# Altium schematic sheet lamps+antenna.SchDoc
size A3; SheetNumber: 1; SheetTotal: 1
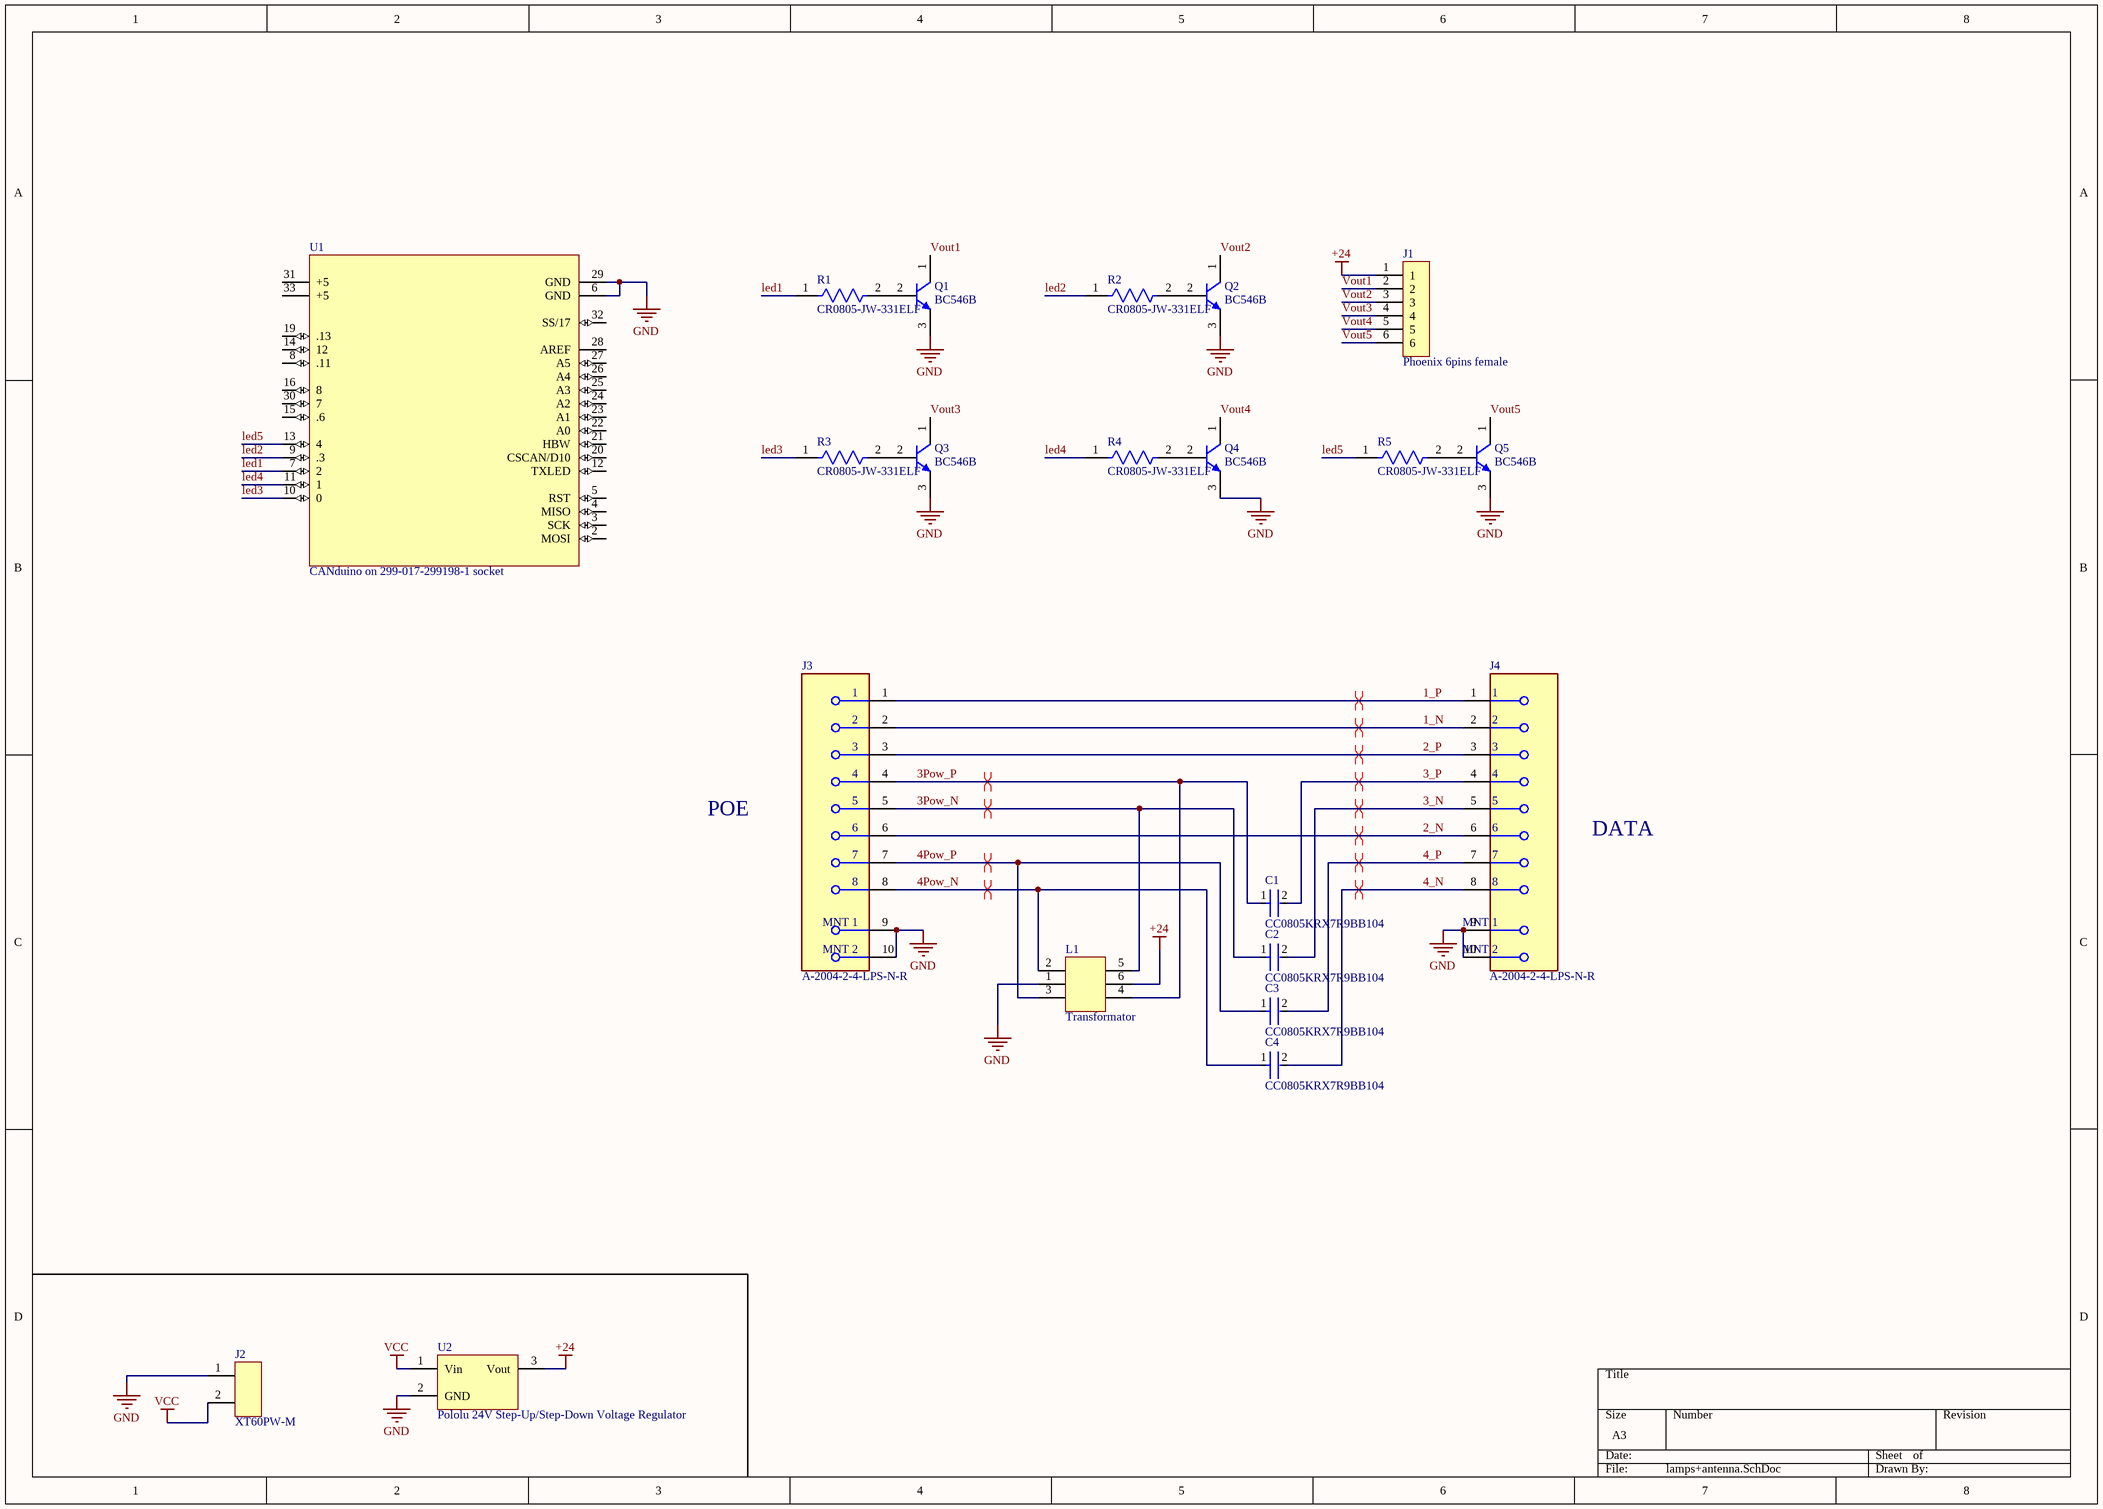
[diagram p0: lamps+antenna.SchDoc]

## Parts
C1  CC0805KRX7R9BB104  [FP-CC0805-0_85-IPC_A]
C2  CC0805KRX7R9BB104  [FP-CC0805-0_85-IPC_A]
C3  CC0805KRX7R9BB104  [FP-CC0805-0_85-IPC_A]
C4  CC0805KRX7R9BB104  [FP-CC0805-0_85-IPC_A]
J1  Phoenix 6pins female  [Phoenix 6pins female]
J2  XT60PW-M  [XT60PW-M]
J3  A-2004-2-4-LPS-N-R  [FP-A-2004-2-4-LPS-N-R-MFG]
J4  A-2004-2-4-LPS-N-R  [FP-A-2004-2-4-LPS-N-R-MFG]
L1  Transformator  [Transformator]
Q1  BC546B  [ONSC-TO-92-3-29-11]
Q2  BC546B  [ONSC-TO-92-3-29-11]
Q3  BC546B  [ONSC-TO-92-3-29-11]
Q4  BC546B  [ONSC-TO-92-3-29-11]
Q5  BC546B  [ONSC-TO-92-3-29-11]
R1  CR0805-JW-331ELF  [FP-CR0805-MFG]
R2  CR0805-JW-331ELF  [FP-CR0805-MFG]
R3  CR0805-JW-331ELF  [FP-CR0805-MFG]
R4  CR0805-JW-331ELF  [FP-CR0805-MFG]
R5  CR0805-JW-331ELF  [FP-CR0805-MFG]
U1  CANduino on 299-017-299198-1 socket  [CANduino on 299-017-299198-1 socket]
U2  Pololu 24V Step-Up/Step-Down Voltage Regulator  [S18V20F12]

## Nets
+24: J1.1 L1.6 U2.3(Vout)
GND: J2.1 J3.9(MNT_1) J3.10(MNT_2) J4.9(MNT_1) J4.10(MNT_2) L1.1 Q1.3(E) Q2.3(E) Q3.3(E) Q4.3(E) Q5.3(E) U1.6(GND) U1.29(GND) U2.2(GND)
VCC: J2.2 U2.1(Vin)
1_N: J3.2 J4.2
1_P: J3.1 J4.1
2_N: J3.6 J4.6
2_P: J3.3 J4.3
3_N: C2.2 J4.5
3_P: C1.2 J4.4
3Pow_N: C2.1 J3.5 L1.5
3Pow_P: C1.1 J3.4 L1.4
4_N: C4.2 J4.8
4_P: C3.2 J4.7
4Pow_N: C4.1 J3.8 L1.2
4Pow_P: C3.1 J3.7 L1.3
led1: R1.1 U1.7(2)
led2: R2.1 U1.9(.3)
led3: R3.1 U1.10(0)
led4: R4.1 U1.11(1)
led5: R5.1 U1.13(4)
Vout1: J1.2 Q1.1(C)
Vout2: J1.3 Q2.1(C)
Vout3: J1.4 Q3.1(C)
Vout4: J1.5 Q4.1(C)
Vout5: J1.6 Q5.1(C)
NetQ1_2: Q1.2(B) R1.2
NetQ2_2: Q2.2(B) R2.2
NetQ3_2: Q3.2(B) R3.2
NetQ4_2: Q4.2(B) R4.2
NetQ5_2: Q5.2(B) R5.2

Not connected (* = marked no-connect by the designer): U1 2(MOSI) 3(SCK) 4(MISO) 5(RST) 8(.11) 12(TXLED) 14(12) 15(.6) 16(8) 19(.13) 20(CSCAN/D10) 21(HBW) 22(A0) 23(A1) 24(A2) 25(A3) 26(A4) 27(A5) 28(AREF) 30(7) 31(+5) 32(SS/17) 33(+5)

## Layout directives
differential pair: 1_N, 1_P, 2_N, 2_P, 3_N, 3_P, 3Pow_N, 3Pow_P, 4_N, 4_P, 4Pow_N, 4Pow_P

## Notes on the sheet
- POE
- DATA

## Library data of the parts
C1-C4 = CMP-2100-03606-3: CAP CER 0.1UF 50V X7R 0805; Manufacturer: Yageo; Tolerance: 0.1; Capacitance: 100 nF; Value: 100 nF; Material: Ceramic; Description: CC0805 100 nF X7R 10.00% 50 V; Device Class L1: Passive Components; ComponentLink2Description: Datasheet; Package: CC0805-0.85; Manufacturer Part Number: CC0805KRX7R9BB104; Digikey Description: CAP CER 0.1UF 50V X7R 0805; Device Class L3: Ceramic Capacitors; Temperature: -30°C to +85°C; Temperature Characteristic: X7R; Voltage Rating: 50 V; Height: 0.95mm; RoHS: TRUE; Ipc Land Pattern Name: CAPC200125X85; Device Class L2: Capacitors; Category: Cap; Temperature Range Low: -30°C; Temperature Range High: +85°C; Mouser Description: Multilayer Ceramic Capacitors MLCC - SMD/SMT 100nF 50V X7R 10%; Footprint Url: http://www.yageo.com/exep/pages/download/literatures/UPY-C_GEN_24.pdf; Automotive: No; Octopart: https://octopart.com/cc0805krx7r9bb104-yageo-192993; Lead Free: Yes; ComponentLink2URL: http://www.yageo.com/documents/recent/UPY-GPHC_Y5V_6.3V-to-50V_8.pdf
J3 J4 = CMP-39752-000001-1: CONN MOD JACK 8P8C R/A SHIELDED; Pitch: 2.54mm; Max Current Rating: 1.5A; Max Voltage Rating (AC): 120V; Direction: Down; Number of Ports: 1; Number of Contacts: 8; Gender: Female; Min Operating Temperature: -40°C; Contact Plating: Gold; Mount: Through Hole; Series: -; Connector Type: Jack; Termination: Solder; Max Operating Temperature: 85°C; RoHS Compliant: Yes; Contact Material: Bronze; Packaging: Tray; Housing Material: PBT; Package Quantity: 100; Orientation: Right Angle; Number of Rows: 1; Lead Free: Lead Free; Shielding: Shielded
Q1-Q5 = CMP-1048-01466-1: Amplifier Transistor, NPN Silicon, 3-Pin TO-92, Bulk Box; Manufacturer: On Semiconductor; IC Continuous (A): 0.1; Note1: 0; fT Min (MHz): 150; PackageDescription: 3-Pin Transistor Outline, Body 4.825 x 3.685 mm, Pitch 1.27 mm; ComponentLink3URL: http://www.onsemi.cn/pub_link/Collateral/2N6426-D.PDF; PackageReference: TO-92-3-29-11_AM_SL; Polarity: NPN; Packing: Bulk Box; PartNumber: BC546B; RoHS: FALSE; DatasheetVersion: Rev. 7; ComponentLink1URL: http://www.onsemi.com/; ComponentLink1Description: Manufacturer URL; Mounting Technology: Through Hole; PackageVersion: Rev. AM; ComponentLink2Description: Datasheet; ComponentLink2URL: http://www.onsemi.com/pub_link/Collateral/BC546-D.PDF; ComponentLink3Description: Package Specification
R1-R5 = CMP-07231-005909-1: Thick Film Chip Resistors 0805 330Ω 0.125W 5% 200ppm/°C; Voltage Rating (DC): 150V; Max Power Dissipation: 125mW; Resistance: 330R; Min Operating Temperature: -55°C; Number of Terminations: 2; Width: 0.049inch; Number of Pins: 2; REACH SVHC: No SVHC; Contact Plating: Tin; Max Operating Temperature: 155°C; Mount: Surface Mount; Case Code (Metric): 2012; Length: 2mm; Package Quantity: 1; Tolerance: 5%; Composition: Thick Film; Packaging: Tape and Reel; Case Code (Imperial): 0805; Radiation Hardening: No; Height: 0.024inch; Thickness: 508um; Case/Package: 0805; Termination: SMD/SMT; Voltage Rating: 150V; Power Rating: 125mW; Depth: 1.25mm; Temperature Coefficient: 200ppm/°C; Features: Moisture Resistant; Military Standard: Not
U1 = CANduino on 299-017-299198-1 socket: CANduino board without pins 1, 17, 18 and 34 due to socket specification
U2 = S18V20F24: pin to pad: 1>Vin 2>GND 3>Vout